# Altium schematic sheet motor1_control.SchDoc
size B; SheetNumber: 3; SheetTotal: 4
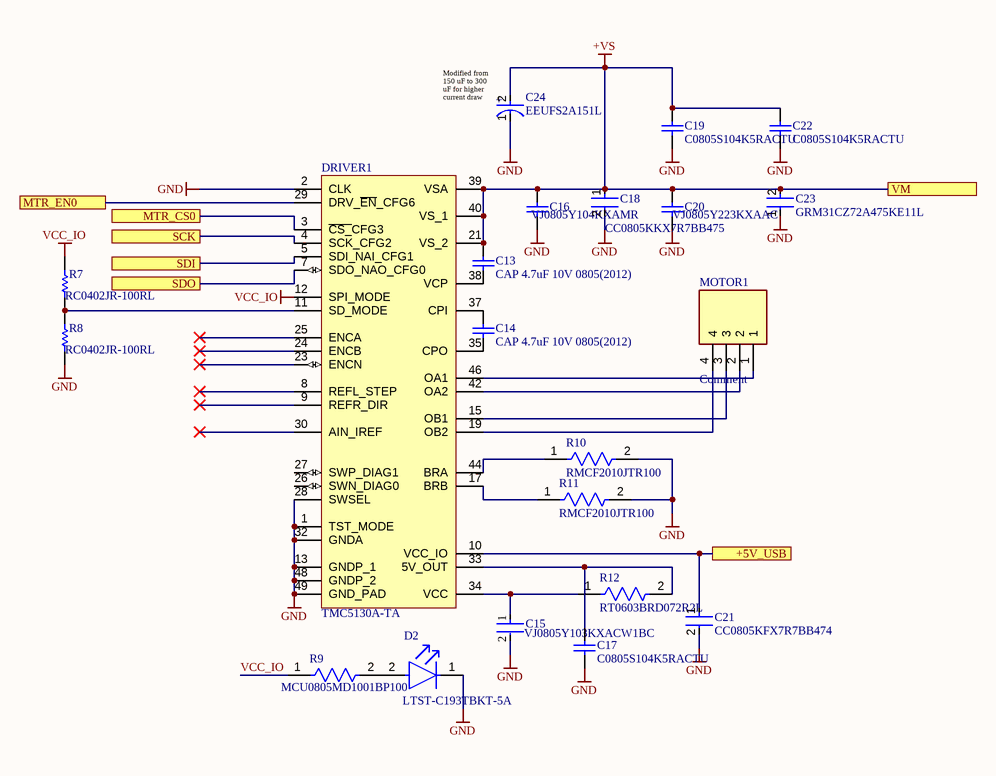
[diagram p0: motor1_control.SchDoc]

## Parts
(Parts that share a designator on the sheet are numbered #1, #2 ... from top to bottom, then left to right.)
?#1  (no value)
?#2  (no value)
?#3  (no value)
?#4  (no value)
?#5  (no value)
?#6  (no value)
?#7  (no value)
?#8  (no value)
?#9  (no value)
?#10  (no value)
?#11  (no value)
?#12  (no value)
?#13  (no value)
C13  CAP 4.7uF 10V 0805(2012)  [CAPC0805(2012)155_L]
C14  CAP 4.7uF 10V 0805(2012)  [CAPC0805(2012)155_L]
C15  VJ0805Y103KXACW1BC  [FP-VJ0805-MFG]
C16  VJ0805Y104KXAMR  [CAPC2013X145X48NL20T23]
C17  C0805S104K5RACTU  [CAPC2013X145X50NL20T25]
C18  CC0805KKX7R7BB475  [FP-CC0805-0_85-MFG]
C19  C0805S104K5RACTU  [CAPC2013X145X50NL20T25]
C20  VJ0805Y223KXAAC  [CAPC2013X145X48NL20T23]
C21  CC0805KFX7R7BB474  [FP-CC0805-0_85-MFG]
C22  C0805S104K5RACTU  [CAPC2013X145X50NL20T25]
C23  GRM31CZ72A475KE11L  [FP-GRM31C-0_3-e0_3_0_9-MFG]
C24  EEUFS2A151L  [FP-RAD-TH-D_10_0_5-L_25_2-MFG]
D2  LTST-C193TBKT-5A  [FP-LTST-C193TBKT-5A-MFG]
DRIVER1  TMC5130A-TA  [TMC5130_TQFP48-EP_0.5_7.0X7.0]
MOTOR1  Comment  [TE_282834-4]
R7  RC0402JR-100RL  [RESC1005X40X25NL05T10]
R8  RC0402JR-100RL  [RESC1005X40X25NL05T10]
R9  MCU0805MD1001BP100  [FP-MCU0805-IPC_A]
R10  RMCF2010JTR100  [FP-RMCF2010-IPC_B]
R11  RMCF2010JTR100  [FP-RMCF2010-IPC_B]
R12  RT0603BRD072R2L  [FP-RT0603-MFG]

## Ports
5V_VM, +5V_USB, MTR_CS0, MTR_CS1, MTR_CS2, MTR_EN0, MTR_EN1, MTR_EN2, RX0, RX1, SCK, SDI, SDO, TX0, TX1, VM

## Nets
GND: C15.2 C16.1 C17.1 C18.2 C19.1 C20.1 C21.2 C22.1 C23.1 C24.1(C) D2.1(C) DRIVER1.1(TST_MODE) DRIVER1.2(CLK) DRIVER1.13(GNDP_1) DRIVER1.28(SWSEL) DRIVER1.32(GNDA) DRIVER1.48(GNDP_2) DRIVER1.49(GND_PAD) R8.2 R10.2 R11.2
VCC_IO: DRIVER1.12(SPI_MODE) R7.1 R9.1
VIN: C13.2 C16.2 C18.1 C19.2 C20.2 C22.2 C23.2 C24.2(A) DRIVER1.21(VS_2) DRIVER1.39(VSA) DRIVER1.40(VS_1) ; port VM  [also labelled +VS]
5V: C21.1 DRIVER1.10(VCC_IO) ; port +5V_USB, port 5V_VM
MISO: DRIVER1.7(SDO_NAO_CFG0) ; port SDO
MOSI: DRIVER1.5(SDI_NAI_CFG1) ; port SDI
PWM2: port MTR_CS2
PWM3: port MTR_EN2
PWM5: DRIVER1.29(DRV_~{EN}_CFG6) ; port MTR_EN0
PWM6: port MTR_EN1
PWM10: DRIVER1.3(~{CS_}CFG3) ; port MTR_CS0
PWM11: port MTR_CS1
RX1: port RX1
RX2: DRIVER1.46(OA1) MOTOR1.1 ; port RX0
SCK: DRIVER1.4(SCK_CFG2) ; port SCK
TX1: port TX1
TX2: port TX0
NetC13_1: C13.1 DRIVER1.38(VCP)
NetC14_1: C14.1 DRIVER1.35(CPO)
NetC14_2: C14.2 DRIVER1.37(CPI)
NetC15_1: C15.1 DRIVER1.34(VCC) R12.1
NetC17_2: C17.2 DRIVER1.33(5V_OUT) R12.2
NetD2_2: D2.2(A) R9.2
NetDRIVER1_11: DRIVER1.11(SD_MODE) R7.2 R8.1
NetDRIVER1_15: DRIVER1.15(OB1) MOTOR1.3
NetDRIVER1_17: DRIVER1.17(BRB) R11.1
NetDRIVER1_19: DRIVER1.19(OB2) MOTOR1.4
NetDRIVER1_42: DRIVER1.42(OA2) MOTOR1.2
NetDRIVER1_44: DRIVER1.44(BRA) R10.1

Not connected (* = marked no-connect by the designer): DRIVER1 8(REFL_STEP)* 9(REFR_DIR)* 23(ENCN)* 24(ENCB)* 25(ENCA)* 26(SWN_DIAG0) 27(SWP_DIAG1) 30(AIN_IREF)*

## Notes on the sheet
- (near C24) Modified from 150 uF to 300 uF for higher current draw
- Labels drawn without touching a wire or pin: PWM4, PWM7, RX0, TX0
- DWG. NO.
- REV.
- SHT.
- THIS DOCUMENT AND THE DATA DISCLOSED HEREIN OR HEREWITH IS THE PROPERTY OF ALTIUM LIMITED AND MAY BE FREELY DISTRIBUTED IN WHOLE. NO RIGHTS ARE RESERVED OR EXPRESS OR IMPLIED WARANTEE GIVEN.
- REVISION
- DESCRIPTION
- DATE
- APPROVED
- 1
- GND point for bench testing
- ENG:
- APPROVALS
- PROJECT
- DSN:
- CHK:
- REFERENCE DOCUMENTS
- PROJECT REVISION:
- TITLE
- DOCUMENT REVISION:
- DESIGN ITEM:
- BOM:
- FAB DWG:
- PCB DWG:
- ASSY DWG:
- SCALE:
- SIZE
- B
- CAGE CODE
- FILE NAME
- DWG NO.
- SHEET
- OF
- REV
- (in symbol CMP-05427-000502-1) +

## Library data of the parts
?#1 = CMP-15817-000010-1: PC TEST POINT NATURAL
?#2 = 282834-4: Conn; Term Blk; PCB; Wire Receptacle; 4; 2.54mm; 30-16AWG; Green; 10A;150V; M1.6 | TE Connectivity 282834-4
?#3 = POWER
?#4 ?#7 = CMP-002-00028-2: Female Header, Pitch 2.54 mm, 1 x 8 Position, Height 8.5 mm, Tail Length 3.2 mm, -40 to 105 degC, RoHS, Bulk
?#5 = CMP-2000-05299-1: Male Header, Pitch 2.54 mm, 1 x 2 Position, Height 9 mm, Tail Length 3.5 mm
?#6 = PWM_H
?#8 = AD_L
?#9 = ICSP
?#10 = PWM_L
?#11 = AD_H
?#12 = Communication
?#13 = IO_36
C13 C14 = CMP-1036-04882-1: CAP 4.7uF 10V ±10% 0805 (2012 Metric) Thickness 1.55mm SMD; Case-EIA: 0805; Tolerance: Â±10%; Case-Metric: 2012; Rated Voltage: 10 V; Max Thickness: 1.55 mm; Technology: SMT; Value: 4.7uF
C15 = CMP-2007-03438-2: NexarPartId: 39476146; Dielectric: X7R; Tolerance: 10%; Voltage: 50V; Dielectric Material: Tantalum; Capacitance: 10nF; Case Code (Imperial): 0805; Case Code (Metric): 2012; Schedule B: 8532240020, 8532240020; Radiation Hardening: No; Packaging: Cut Tape; Thickness: 939.8µm; Width: 1.2446mm; Lead Free: Lead Free; RoHS: Compliant; Depth: 1.25mm; Number of Pins: 2; Mount: Surface Mount; Case/Package: 0805; Length: 2mm; Termination: SMD/SMT; Max Operating Temperature: 125°C; REACH SVHC: Unknown; Min Operating Temperature: -55°C; Voltage Rating: 50V; Height: 1.45mm; Voltage Rating (DC): 50V
C16 = CMP-2007-01705-1: Manufacturer: Vitramon; Part Number: VJ0805Y104KXAMR
C17 C19 C22 = CMP-2007-01227-1: Manufacturer: Kemet; Part Number: C0805S104K5RACTU
C18 = CMP-03422-000207-1: CAP CER 4.7UF 16V X7R 0805; Manufacturer: Yageo; Tolerance: 0.1; Material: Ceramic; Footprint Url: http://www.yageo.com/exep/pages/download/literatures/UPY-C_GEN_24.pdf; Device Class L3: Ceramic Capacitors; Temperature: -30°C to +85°C; Device Class L2: Capacitors; Automotive: No; Digikey Description: CAP CER 4.7UF 16V X7R 0805; Temperature Range High: +85°C; Lead Free: Yes; Mouser Description: Multilayer Ceramic Capacitors MLCC - SMD/SMT 4.7M pF 10% 16 Volts; Temperature Characteristic: X7R; Height: 0.95mm; Device Class L1: Passive Components; ComponentLink2Description: Datasheet; Category: Cap; Octopart: https://octopart.com/cc0805kkx7r7bb475-yageo-34429188; Temperature Range Low: -30°C; Manufacturer Part Number: CC0805KKX7R7BB475; Package: CC0805-0.85; Ipc Land Pattern Name: CAPC200125X85; RoHS: TRUE; Value: 4.7 uF; Capacitance: 4.7 uF; ComponentLink2URL: http://www.yageo.com/documents/recent/UPY-GPHC_Y5V_6.3V-to-50V_8.pdf; Voltage Rating: 16 V
C20 = CMP-2007-01723-1: Manufacturer: Vitramon; Part Number: VJ0805Y223KXAAC
C21 = CMP-03422-001203-1: CC0805 470 nF X7R 10.00% 16 V; Manufacturer: Yageo; Tolerance: 0.1; Voltage Rating: 16 V; Value: 470 nF; Material: Ceramic; Device Class L1: Passive Components; Footprint Url: http://www.yageo.com/exep/pages/download/literatures/UPY-C_GEN_24.pdf; Temperature Range Low: -30°C; Octopart: https://octopart.com/cc0805kfx7r7bb474-yageo-24732839; Temperature Range High: +85°C; Mouser Description: Multilayer Ceramic Capacitors MLCC - SMD/SMT 470nF 16V X7R 10%; Height: 0.95mm; Manufacturer Part Number: CC0805KFX7R7BB474; Device Class L3: Ceramic Capacitors; Automotive: No; RoHS: TRUE; Temperature: -30°C to +85°C; Lead Free: Yes; ComponentLink2URL: http://www.yageo.com/documents/recent/UPY-GPHC_Y5V_6.3V-to-50V_8.pdf; Device Class L2: Capacitors; Temperature Characteristic: X7R; ComponentLink2Description: Datasheet; Ipc Land Pattern Name: CAPC200125X85; Package: CC0805-0.85; Capacitance: 470 nF; Category: Cap
C23 = CMP-06035-056253-1: Chip Multilayer Ceramic Capacitors for General Purpose, 1206, 4.7uF, X7R, 15%, 10%, 100V
C24 = CMP-05427-000502-1: Aluminum Electrolytic Capacitors (Radial Lead Type) 150uF ±20% 100V; RoHS Compliant: Yes
D2 = CMP-2000-06624-2: LED BLUE CLEAR CHIP SMD; Number of Elements: 1; Forward Voltage: 2.8V; Forward Current: 20mA; Test Current: 5mA; Lens Color: Colorless; Dominant Wavelength: 475nm; Reverse Voltage: 5V; Viewing Angle: 130°; Lens Style: Diffused; Luminous Intensity: 15mcd; Power Dissipation: 76mW; Max Operating Temperature: 80°C; Length: 1.6mm; Number of LEDs: 1; Case/Package: 0603; Case Code (Metric): 1608; Number of Pins: 2; Radiation Hardening: No; Min Operating Temperature: -20°C; Width: 0.8mm; Packaging: Tape and Reel; Package Quantity: 1; Lead Free: Lead Free; Lens Transparency: Clear; Illumination Color: Blue; Color: Blue; RoHS Compliant: Yes; Mount: Surface Mount; Depth: 0.8mm; Case Code (Imperial): 0603; Height: 0.35mm
DRIVER1 = TMC5130A-TA: High voltage(up to 46V) controller for two-phase bipolar stepper motor, with SPI, Step/Dir, UART, TQFP48-EP(7x7); Manufacturer: TRINAMIC; Geometry.Height: 1,2mm; Ordercode - Distri#1: 1460-1124-ND; Datasheet: http://www.trinamic.com/_scripts/download.php?file=_articles%2Fproducts%2Fintegrated-circuits%2Ftmc5130%2F_datasheet%2FTMC5130_datasheet.pdf; Distributor#1: Digikey; Distributor#2: *; Ordercode - Distri#2: *; Ordercode - Manu#1: TMC5130A-TA; Value: TMC5130A-TA; MPN: TMC5130A-TA; MF: TRINAMIC
MOTOR1 = 282834-4: Conn; Term Blk; PCB; Wire Receptacle; 4; 2.54mm; 30-16AWG; Green; 10A;150V; M1.6 | TE Connectivity 282834-4; Number_of_Positions: 4; Centerline_Pitch: 2.54 mm[.1 in]; SnapEDA_Link: https://www.snapeda.com/parts/282834-4/TE+Connectivity+AMP+Connectors/view-part/?ref=snap; Package: None; Value: *; MF: TE Connectivity; MP: 282834-4; EU_RoHS_Compliance: Compliant with Exemptions; Check_prices: https://www.snapeda.com/parts/282834-4/TE+Connectivity+AMP+Connectors/view-part/?ref=eda
R7 R8 = CMP-2002-06970-1: Manufacturer: Yageo; Part Number: RC0402JR-100RL
R9 = CMP-02407-000288-1: RES 1.05K OHM 0.5% 1/5W 0805; Tolerance: 0.1%; Resistance: 1kR; Power Rating: 200mW; Voltage Rating: 150V; Max Operating Temperature: 155°C; Width: 1.25mm; Min Operating Temperature: -55°C; Case Code (Metric): 2012; Packaging: Tape and Reel; Case Code (Imperial): 0805; Length: 2mm; Height: 0.52mm; Case/Package: 0805; Weight: 0.000162oz; Composition: Thin Film
R10 R11 = CMP-26527-004988-1: 0.1Ω ±5% 0.75W 2010 Thick Film Chip Resistor AEC-Q200 compliant; Resistance: 100mR; Max Power Dissipation: 750mW; Temperature Coefficient: 200ppm/°C; Width: 0.098inch; Construction: Rectangular; Case Code (Imperial): 2010; Number of Terminations: 2; Case/Package: 0201; Series: RMCF; Mount: Surface Mount; Resistor Type: Thick Film; Military Standard: Not; Height: 0.028inch; Tolerance: 5%; Depth: 0.3mm; Contact Plating: Tin; Length: 0.197inch; Max Operating Temperature: 155°C; Radiation Hardening: No; Min Operating Temperature: -55°C; Case Code (Metric): 5025; Features: Automotive AEC-Q200; RoHS Compliant: Yes; Packaging: Tape and Reel
R12 = CMP-03412-032977-1: RT0603 2.2Ω 0.1W 25 ppm/°C 0.10%; Manufacturer: Yageo; Voltage Rating: 75V; Tolerance: 0.001; Octopart: https://octopart.com/rt0603brd072r2l-yageo-80827805; Temperature: -55°C to +155°C; Category: Res; Temperature Range High: +155°C; Device Class L2: Resistors; Value: 2.2Ω; Composition: Thin Film; Ipc Land Pattern Name: RESC16080X45; Temperature Range Low: -55°C; Footprint Url: http://www.yageo.com/exep/pages/download/literatures/PYu-R_Mount_10.pdf; Resistance: 2.2Ω; Package: RT0603; Automotive: No; Power Rating: 0.1W; Manufacturer Part Number: RT0603BRD072R2L; Lead Free: Yes; RoHS: TRUE; Series: RT; Device Class L3: Chip SMD Resistors; Height: 0.55mm; Temperature Coefficient: 25 ppm/°C; ComponentLink2Description: Datasheet; ComponentLink2URL: http://www.yageo.com/documents/recent/PYu-RT_1-to-0.01_RoHS_L_9.pdf; Device Class L1: Passive Components